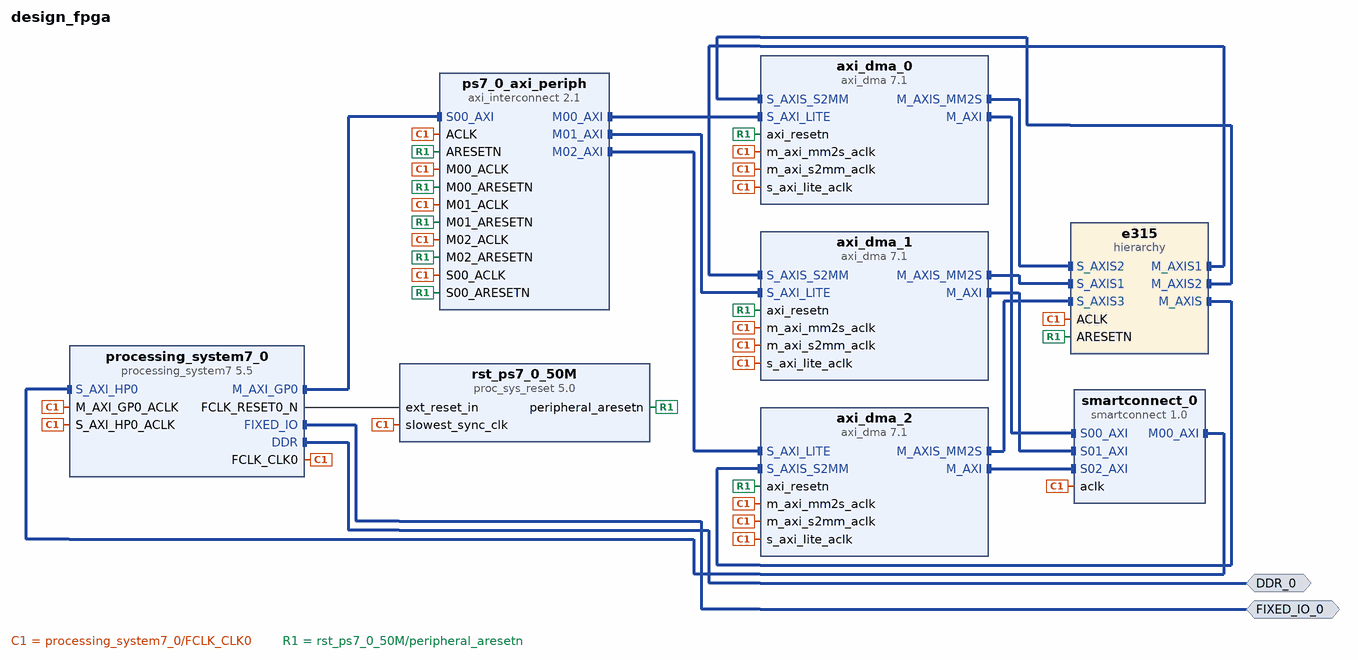
[diagram p0: block diagram of the top level]
# Vivado block design design_fpga, xc7z020clg400-1, Vivado 2020.2
create_bd_design design_fpga

create_bd_intf_port -mode Master -vlnv xilinx.com:interface:ddrx_rtl:1.0 DDR_0
create_bd_intf_port -mode Master -vlnv xilinx.com:display_processing_system7:fixedio_rtl:1.0 FIXED_IO_0

create_bd_cell -type hier e315
create_bd_cell -type ip -vlnv xilinx.com:ip:axi_interconnect:2.1 ps7_0_axi_periph
set_property -dict {CONFIG.NUM_MI 3} [get_bd_cells ps7_0_axi_periph]
create_bd_cell -type ip -vlnv xilinx.com:ip:axi_dma:7.1 axi_dma_0
set_property -dict {CONFIG.c_include_sg 0 CONFIG.c_single_interface 1} [get_bd_cells axi_dma_0]
create_bd_cell -type ip -vlnv xilinx.com:ip:axi_dma:7.1 axi_dma_1
set_property -dict {CONFIG.c_include_sg 0 CONFIG.c_single_interface 1} [get_bd_cells axi_dma_1]
create_bd_cell -type ip -vlnv xilinx.com:ip:axi_dma:7.1 axi_dma_2
set_property -dict {CONFIG.c_include_sg 0 CONFIG.c_single_interface 1} [get_bd_cells axi_dma_2]
create_bd_cell -type ip -vlnv xilinx.com:ip:processing_system7:5.5 processing_system7_0
set_property -dict [list \
  CONFIG.PCW_APU_PERIPHERAL_FREQMHZ 650 \
  CONFIG.PCW_CRYSTAL_PERIPHERAL_FREQMHZ 50 \
  CONFIG.PCW_ENET0_ENET0_IO {MIO 16 .. 27} \
  CONFIG.PCW_ENET0_GRP_MDIO_ENABLE 1 \
  CONFIG.PCW_ENET0_GRP_MDIO_IO {MIO 52 .. 53} \
  CONFIG.PCW_ENET0_PERIPHERAL_ENABLE 1 \
  CONFIG.PCW_ENET0_RESET_ENABLE 1 \
  CONFIG.PCW_ENET0_RESET_IO {MIO 9} \
  CONFIG.PCW_ENET_RESET_ENABLE 1 \
  CONFIG.PCW_ENET_RESET_SELECT {Share reset pin} \
  CONFIG.PCW_FPGA0_PERIPHERAL_FREQMHZ 100 \
  CONFIG.PCW_FPGA1_PERIPHERAL_FREQMHZ 50 \
  CONFIG.PCW_GPIO_MIO_GPIO_ENABLE 1 \
  CONFIG.PCW_GPIO_MIO_GPIO_IO MIO \
  CONFIG.PCW_I2C_RESET_ENABLE 0 \
  CONFIG.PCW_M_AXI_GP0_FREQMHZ 10 \
  CONFIG.PCW_PERIPHERAL_BOARD_PRESET part0 \
  CONFIG.PCW_PRESET_BANK1_VOLTAGE {LVCMOS 1.8V} \
  CONFIG.PCW_QSPI_GRP_FBCLK_ENABLE 1 \
  CONFIG.PCW_QSPI_GRP_FBCLK_IO {MIO 8} \
  CONFIG.PCW_QSPI_GRP_SINGLE_SS_ENABLE 1 \
  CONFIG.PCW_QSPI_GRP_SINGLE_SS_IO {MIO 1 .. 6} \
  CONFIG.PCW_QSPI_PERIPHERAL_ENABLE 1 \
  CONFIG.PCW_QSPI_QSPI_IO {MIO 1 .. 6} \
  CONFIG.PCW_SD0_GRP_CD_ENABLE 1 \
  CONFIG.PCW_SD0_GRP_CD_IO {MIO 47} \
  CONFIG.PCW_SD0_GRP_WP_ENABLE 0 \
  CONFIG.PCW_SD0_PERIPHERAL_ENABLE 1 \
  CONFIG.PCW_SD0_SD0_IO {MIO 40 .. 45} \
  CONFIG.PCW_SDIO_PERIPHERAL_FREQMHZ 50 \
  CONFIG.PCW_SINGLE_QSPI_DATA_MODE x4 \
  CONFIG.PCW_S_AXI_HP0_FREQMHZ 10 \
  CONFIG.PCW_UART0_PERIPHERAL_ENABLE 1 \
  CONFIG.PCW_UART0_UART0_IO {MIO 14 .. 15} \
  CONFIG.PCW_UART1_PERIPHERAL_ENABLE 0 \
  CONFIG.PCW_UART_PERIPHERAL_FREQMHZ 100 \
  CONFIG.PCW_UIPARAM_DDR_BUS_WIDTH {16 Bit} \
  CONFIG.PCW_UIPARAM_DDR_FREQ_MHZ 525 \
  CONFIG.PCW_UIPARAM_DDR_PARTNO {MT41J256M16 RE-125} \
  CONFIG.PCW_USB0_PERIPHERAL_ENABLE 1 \
  CONFIG.PCW_USB0_RESET_ENABLE 1 \
  CONFIG.PCW_USB0_RESET_IO {MIO 46} \
  CONFIG.PCW_USB0_USB0_IO {MIO 28 .. 39} \
  CONFIG.PCW_USB_RESET_ENABLE 1 \
  CONFIG.PCW_USB_RESET_SELECT {Share reset pin} \
  CONFIG.PCW_USE_S_AXI_HP0 1 \
] [get_bd_cells processing_system7_0]
# 499 more settings of processing_system7_0 are not shown: defaults, MIO pin electricals, DDR timing, and values the tool derives
create_bd_cell -type ip -vlnv xilinx.com:ip:proc_sys_reset:5.0 rst_ps7_0_50M
create_bd_cell -type ip -vlnv xilinx.com:ip:smartconnect:1.0 smartconnect_0
set_property -dict {CONFIG.NUM_SI 3} [get_bd_cells smartconnect_0]

# ---- hierarchy /e315 ----
current_bd_instance /e315
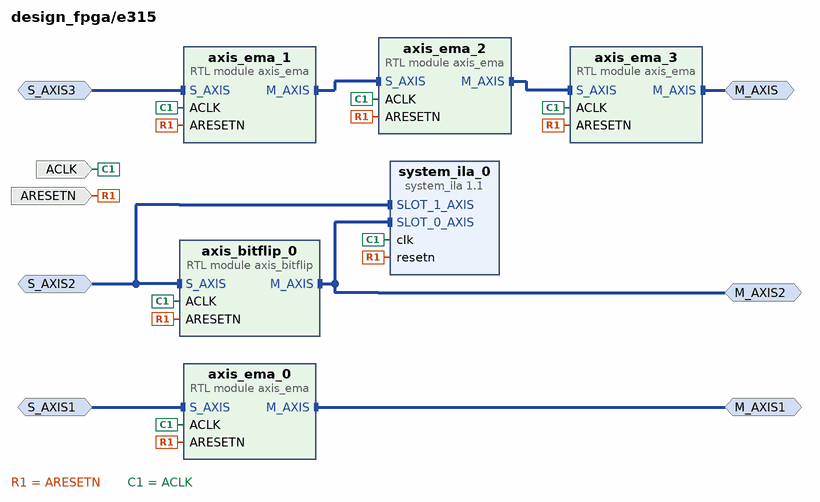
[diagram p1: block diagram inside /e315]
create_bd_intf_pin -mode Slave -vlnv xilinx.com:interface:axis_rtl:1.0 S_AXIS2
create_bd_intf_pin -mode Master -vlnv xilinx.com:interface:axis_rtl:1.0 M_AXIS2
create_bd_intf_pin -mode Slave -vlnv xilinx.com:interface:axis_rtl:1.0 S_AXIS1
create_bd_intf_pin -mode Master -vlnv xilinx.com:interface:axis_rtl:1.0 M_AXIS1
create_bd_intf_pin -mode Slave -vlnv xilinx.com:interface:axis_rtl:1.0 S_AXIS3
create_bd_intf_pin -mode Master -vlnv xilinx.com:interface:axis_rtl:1.0 M_AXIS
create_bd_pin -dir I -type rst ARESETN
create_bd_pin -dir I -type clk ACLK

create_bd_cell -type module -reference axis_bitflip axis_bitflip_0
create_bd_cell -type module -reference axis_ema axis_ema_0
create_bd_cell -type module -reference axis_ema axis_ema_1
create_bd_cell -type module -reference axis_ema axis_ema_2
create_bd_cell -type module -reference axis_ema axis_ema_3
create_bd_cell -type ip -vlnv xilinx.com:ip:system_ila:1.1 system_ila_0
set_property -dict [list \
  CONFIG.C_MON_TYPE INTERFACE \
  CONFIG.C_NUM_MONITOR_SLOTS 2 \
  CONFIG.C_SLOT_0_APC_EN 0 \
  CONFIG.C_SLOT_0_AXI_DATA_SEL 1 \
  CONFIG.C_SLOT_0_AXI_TRIG_SEL 1 \
  CONFIG.C_SLOT_0_INTF_TYPE xilinx.com:interface:axis_rtl:1.0 \
  CONFIG.C_SLOT_1_APC_EN 0 \
  CONFIG.C_SLOT_1_AXI_DATA_SEL 1 \
  CONFIG.C_SLOT_1_AXI_TRIG_SEL 1 \
  CONFIG.C_SLOT_1_INTF_TYPE xilinx.com:interface:axis_rtl:1.0 \
  CONFIG.C_SLOT_2_APC_EN 0 \
  CONFIG.C_SLOT_2_AXI_DATA_SEL 1 \
  CONFIG.C_SLOT_2_AXI_TRIG_SEL 1 \
  CONFIG.C_SLOT_2_INTF_TYPE xilinx.com:interface:axis_rtl:1.0 \
] [get_bd_cells system_ila_0]

# ---- connections ----

current_bd_instance /e315
connect_bd_intf_net -intf_net Conn3 [get_bd_intf_pins M_AXIS2] [get_bd_intf_pins axis_bitflip_0/M_AXIS]
connect_bd_intf_net [get_bd_intf_pins M_AXIS2] [get_bd_intf_pins system_ila_0/SLOT_0_AXIS]
connect_bd_intf_net [get_bd_intf_pins M_AXIS] [get_bd_intf_pins axis_ema_3/M_AXIS]
connect_bd_intf_net [get_bd_intf_pins M_AXIS1] [get_bd_intf_pins axis_ema_0/M_AXIS]
connect_bd_intf_net [get_bd_intf_pins axis_ema_1/M_AXIS] [get_bd_intf_pins axis_ema_2/S_AXIS]
connect_bd_intf_net [get_bd_intf_pins S_AXIS1] [get_bd_intf_pins axis_ema_0/S_AXIS]
connect_bd_intf_net [get_bd_intf_pins S_AXIS3] [get_bd_intf_pins axis_ema_1/S_AXIS]
connect_bd_intf_net [get_bd_intf_pins axis_ema_2/M_AXIS] [get_bd_intf_pins axis_ema_3/S_AXIS]
connect_bd_intf_net -intf_net Conn6 [get_bd_intf_pins S_AXIS2] [get_bd_intf_pins axis_bitflip_0/S_AXIS]
connect_bd_intf_net [get_bd_intf_pins S_AXIS2] [get_bd_intf_pins system_ila_0/SLOT_1_AXIS]
connect_bd_net [get_bd_pins ARESETN] \
  [get_bd_pins axis_bitflip_0/ARESETN] [get_bd_pins axis_ema_0/ARESETN] [get_bd_pins axis_ema_1/ARESETN] \
  [get_bd_pins axis_ema_2/ARESETN] [get_bd_pins axis_ema_3/ARESETN] [get_bd_pins system_ila_0/resetn]
connect_bd_net [get_bd_pins ACLK] \
  [get_bd_pins axis_bitflip_0/ACLK] [get_bd_pins axis_ema_0/ACLK] [get_bd_pins axis_ema_1/ACLK] [get_bd_pins axis_ema_2/ACLK] \
  [get_bd_pins axis_ema_3/ACLK] [get_bd_pins system_ila_0/clk]
set_property HDL_ATTRIBUTE.DEBUG true [get_bd_intf_nets Conn3]
set_property HDL_ATTRIBUTE.MARK_DEBUG true [get_bd_intf_nets Conn3]
set_property HDL_ATTRIBUTE.DEBUG true [get_bd_intf_nets Conn6]

current_bd_instance /
connect_bd_intf_net [get_bd_intf_pins ps7_0_axi_periph/M02_AXI] [get_bd_intf_pins axi_dma_2/S_AXI_LITE]
connect_bd_intf_net [get_bd_intf_pins processing_system7_0/S_AXI_HP0] [get_bd_intf_pins smartconnect_0/M00_AXI]
connect_bd_intf_net [get_bd_intf_pins axi_dma_2/S_AXIS_S2MM] [get_bd_intf_pins e315/M_AXIS]
connect_bd_intf_net [get_bd_intf_pins axi_dma_2/M_AXIS_MM2S] [get_bd_intf_pins e315/S_AXIS3]
connect_bd_intf_net [get_bd_intf_pins axi_dma_1/S_AXIS_S2MM] [get_bd_intf_pins e315/M_AXIS1]
connect_bd_intf_net [get_bd_intf_ports FIXED_IO_0] [get_bd_intf_pins processing_system7_0/FIXED_IO]
connect_bd_intf_net [get_bd_intf_pins ps7_0_axi_periph/M00_AXI] [get_bd_intf_pins axi_dma_0/S_AXI_LITE]
connect_bd_intf_net [get_bd_intf_pins smartconnect_0/S00_AXI] [get_bd_intf_pins axi_dma_0/M_AXI]
connect_bd_intf_net [get_bd_intf_pins processing_system7_0/M_AXI_GP0] [get_bd_intf_pins ps7_0_axi_periph/S00_AXI]
connect_bd_intf_net [get_bd_intf_pins smartconnect_0/S01_AXI] [get_bd_intf_pins axi_dma_1/M_AXI]
connect_bd_intf_net [get_bd_intf_pins ps7_0_axi_periph/M01_AXI] [get_bd_intf_pins axi_dma_1/S_AXI_LITE]
connect_bd_intf_net -intf_net S_AXIS1_1 [get_bd_intf_pins axi_dma_1/M_AXIS_MM2S] [get_bd_intf_pins e315/S_AXIS1]
connect_bd_intf_net -intf_net e315_M_AXIS2 [get_bd_intf_pins axi_dma_0/S_AXIS_S2MM] [get_bd_intf_pins e315/M_AXIS2]
connect_bd_intf_net [get_bd_intf_ports DDR_0] [get_bd_intf_pins processing_system7_0/DDR]
connect_bd_intf_net -intf_net S_AXIS2_1 [get_bd_intf_pins axi_dma_0/M_AXIS_MM2S] [get_bd_intf_pins e315/S_AXIS2]
connect_bd_intf_net [get_bd_intf_pins axi_dma_2/M_AXI] [get_bd_intf_pins smartconnect_0/S02_AXI]
connect_bd_net [get_bd_pins processing_system7_0/FCLK_RESET0_N] [get_bd_pins rst_ps7_0_50M/ext_reset_in]
connect_bd_net [get_bd_pins processing_system7_0/FCLK_CLK0] \
  [get_bd_pins processing_system7_0/M_AXI_GP0_ACLK] [get_bd_pins processing_system7_0/S_AXI_HP0_ACLK] [get_bd_pins e315/ACLK] \
  [get_bd_pins axi_dma_0/m_axi_mm2s_aclk] [get_bd_pins axi_dma_0/m_axi_s2mm_aclk] [get_bd_pins axi_dma_0/s_axi_lite_aclk] \
  [get_bd_pins ps7_0_axi_periph/M00_ACLK] [get_bd_pins smartconnect_0/aclk] [get_bd_pins rst_ps7_0_50M/slowest_sync_clk] \
  [get_bd_pins axi_dma_1/m_axi_mm2s_aclk] [get_bd_pins axi_dma_1/m_axi_s2mm_aclk] [get_bd_pins axi_dma_1/s_axi_lite_aclk] \
  [get_bd_pins ps7_0_axi_periph/M01_ACLK] [get_bd_pins axi_dma_2/m_axi_mm2s_aclk] [get_bd_pins axi_dma_2/m_axi_s2mm_aclk] \
  [get_bd_pins axi_dma_2/s_axi_lite_aclk] [get_bd_pins ps7_0_axi_periph/M02_ACLK] [get_bd_pins ps7_0_axi_periph/ACLK] \
  [get_bd_pins ps7_0_axi_periph/S00_ACLK]
connect_bd_net -net ARESETN_1 [get_bd_pins rst_ps7_0_50M/peripheral_aresetn] \
  [get_bd_pins e315/ARESETN] [get_bd_pins axi_dma_0/axi_resetn] [get_bd_pins ps7_0_axi_periph/M00_ARESETN] \
  [get_bd_pins axi_dma_1/axi_resetn] [get_bd_pins ps7_0_axi_periph/M01_ARESETN] [get_bd_pins axi_dma_2/axi_resetn] \
  [get_bd_pins ps7_0_axi_periph/M02_ARESETN] [get_bd_pins ps7_0_axi_periph/ARESETN] \
  [get_bd_pins ps7_0_axi_periph/S00_ARESETN]
set_property HDL_ATTRIBUTE.DEBUG true [get_bd_intf_nets e315_M_AXIS2]
set_property HDL_ATTRIBUTE.MARK_DEBUG true [get_bd_intf_nets e315_M_AXIS2]
set_property HDL_ATTRIBUTE.DEBUG true [get_bd_intf_nets S_AXIS2_1]
set_property HDL_ATTRIBUTE.MARK_DEBUG true [get_bd_intf_nets S_AXIS2_1]

# ---- address map ----
assign_bd_address -offset 0x00000000 -range 512M -target_address_space [get_bd_addr_spaces axi_dma_0/Data] [get_bd_addr_segs processing_system7_0/S_AXI_HP0/HP0_DDR_LOWOCM]
assign_bd_address -offset 0x00000000 -range 512M -target_address_space [get_bd_addr_spaces axi_dma_1/Data] [get_bd_addr_segs processing_system7_0/S_AXI_HP0/HP0_DDR_LOWOCM]
assign_bd_address -offset 0x00000000 -range 512M -target_address_space [get_bd_addr_spaces axi_dma_2/Data] [get_bd_addr_segs processing_system7_0/S_AXI_HP0/HP0_DDR_LOWOCM]
assign_bd_address -offset 0x40400000 -range 64K -target_address_space [get_bd_addr_spaces processing_system7_0/Data] [get_bd_addr_segs axi_dma_0/S_AXI_LITE/Reg]
assign_bd_address -offset 0x40410000 -range 64K -target_address_space [get_bd_addr_spaces processing_system7_0/Data] [get_bd_addr_segs axi_dma_1/S_AXI_LITE/Reg]
assign_bd_address -offset 0x40420000 -range 64K -target_address_space [get_bd_addr_spaces processing_system7_0/Data] [get_bd_addr_segs axi_dma_2/S_AXI_LITE/Reg]

validate_bd_design
save_bd_design
